# EAGLE design untitled (EAGLE 6.4)
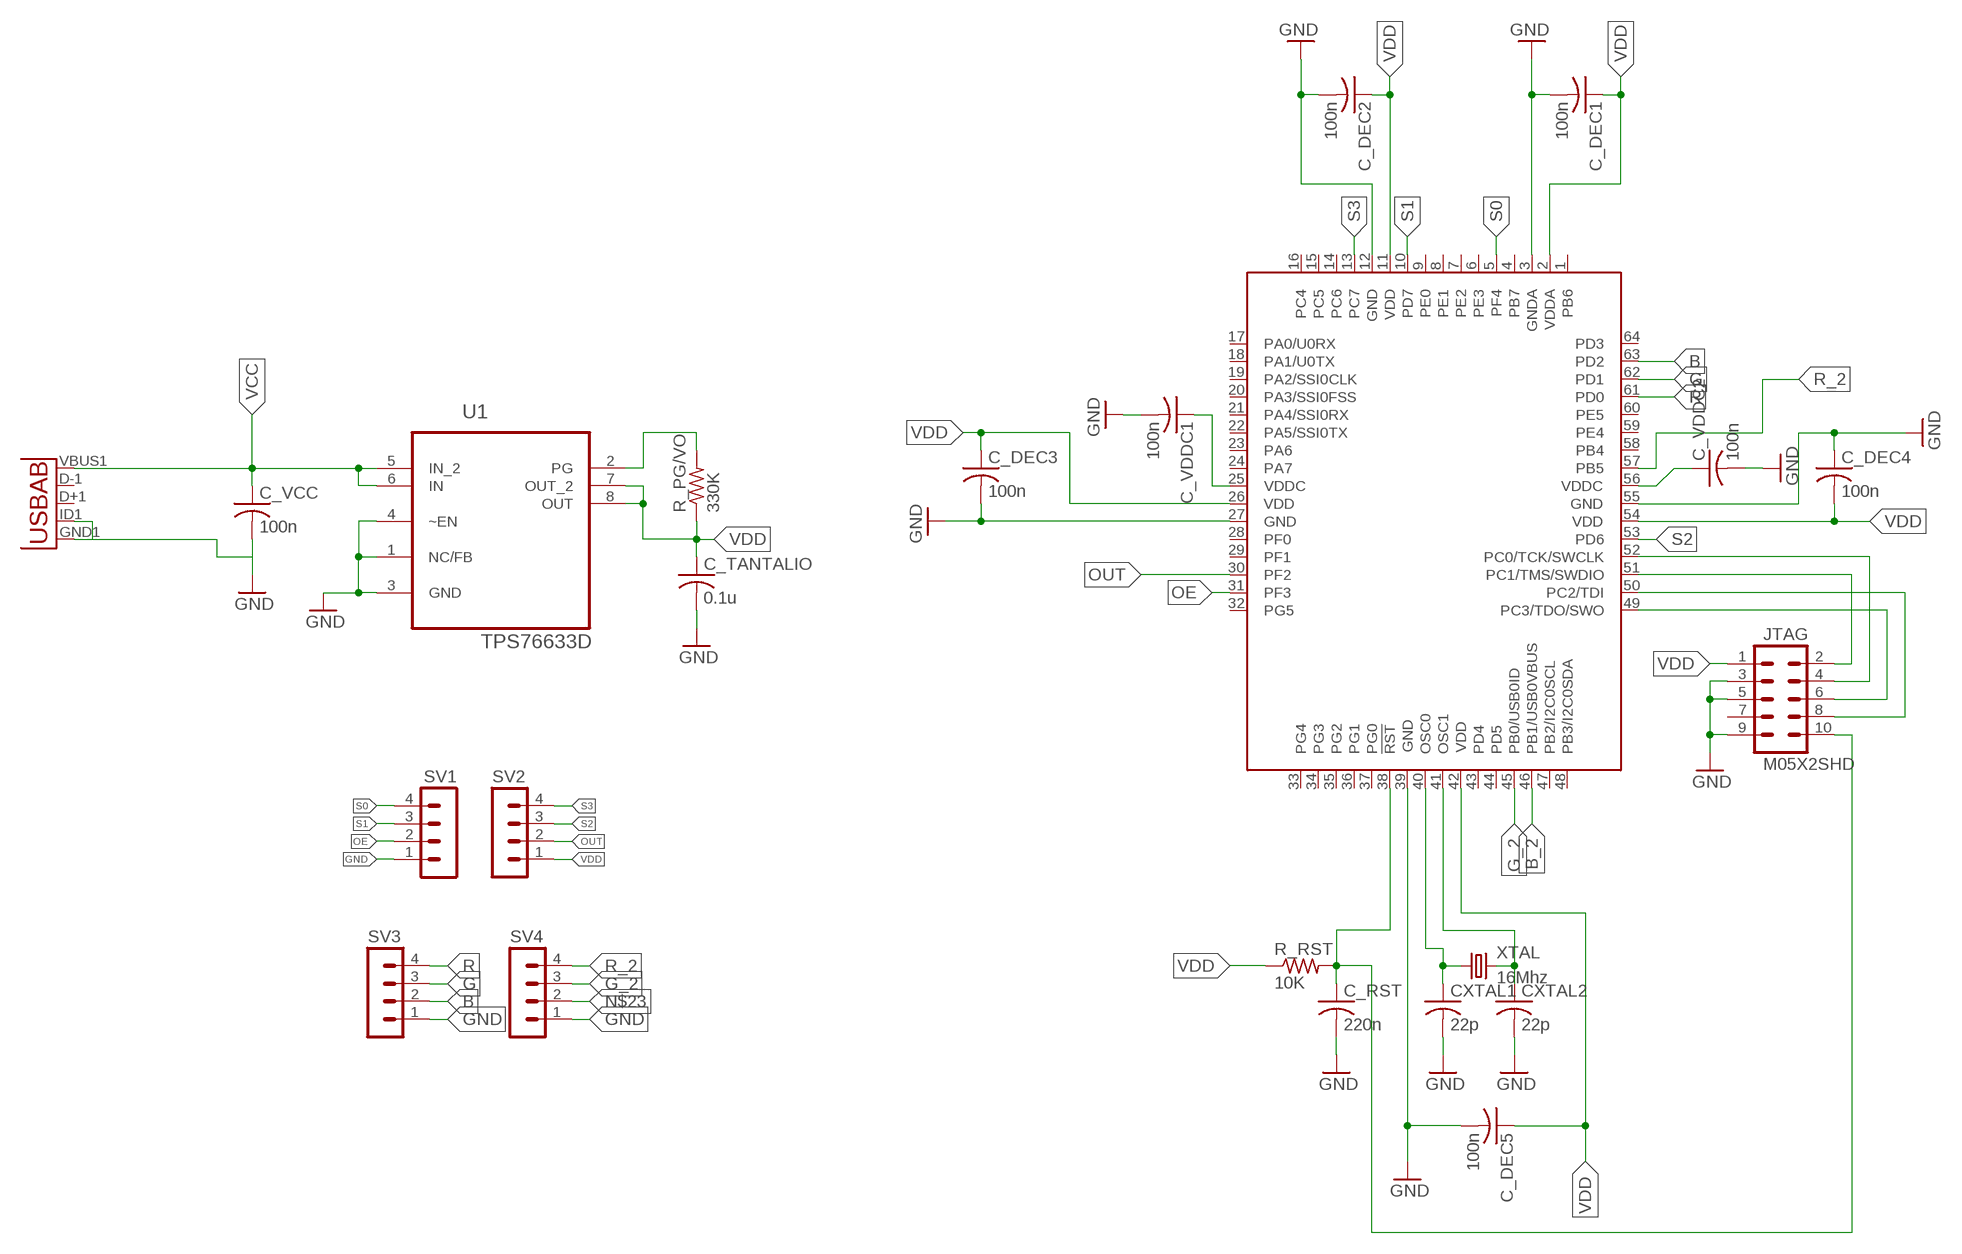
[diagram p0: schematic, sheet 1]

## Parts
C_DEC1  100n  C-USC0805  [C0805]
C_DEC2  100n  C-USC0805  [C0805]
C_DEC3  100n  C-USC0805  [C0805]
C_DEC4  100n  C-USC0805  [C0805]
C_DEC5  100n  C-USC0805  [C0805]
C_RST  220n  C-USC0805  [C0805]
C_TANTALIO  0.1u  C-USC1206  [C1206]
C_VCC  100n  C-USC0805  [C0805]
C_VDDC1  100n  C-USC0805  [C0805]
C_VDDC2  100n  C-USC0805  [C0805]
CXTAL1  22p  C-USC0805  [C0805]
CXTAL2  22p  C-USC0805  [C0805]
JTAG  M05X2SHD  [2X5-SHROUDED]
R_PG/VO  330K  R-US_M1206  [M1206]
R_RST  10K  R-US_M1206  [M1206]
SV1  MA04-1  [MA04-1]
SV2  MA04-1  [MA04-1]
SV3  MA04-1  [MA04-1]
SV4  MA04-1  [MA04-1]
TM4C123FH6PM  TM4C123[6,F]XXPM  [PM_S-PQFP-G64]
U1  TPS76633D  [SOIC127P600X175-8N]
U3  USB""  [USB-MICRO-SMD]
XTAL  16Mhz  CRYSTALHC49UP  [HC49UP]

## Nets
B: SV3.2 TM4C123FH6PM.63(PD2)
B_2: TM4C123FH6PM.46(PB1/USB0VBUS)
G: SV3.3 TM4C123FH6PM.62(PD1)
G_2: SV4.3 TM4C123FH6PM.45(PB0/USB0ID)
GND: C_DEC1.2 C_DEC2.2 C_DEC3.2 C_DEC4.1 C_DEC5.2 C_RST.2 C_TANTALIO.2 C_VCC.2 C_VDDC1.2 C_VDDC2.2 CXTAL1.2 CXTAL2.2 JTAG.3 JTAG.5 JTAG.9 SV1.1 SV3.1 SV4.1 TM4C123FH6PM.3(GNDA) TM4C123FH6PM.12(GND) TM4C123FH6PM.27(GND) TM4C123FH6PM.39(GND) TM4C123FH6PM.55(GND) U1.1(NC/FB) U1.3(GND) U1.4(~EN) U3.GND1(GND) U3.ID1(USBID)
N$1: CXTAL1.1 TM4C123FH6PM.40(OSC0) XTAL.1
N$2: CXTAL2.1 TM4C123FH6PM.41(OSC1) XTAL.2
N$5: C_VDDC1.1 TM4C123FH6PM.25(VDDC)
N$6: JTAG.2 TM4C123FH6PM.51(PC1/TMS/SWDIO)
N$7: JTAG.4 TM4C123FH6PM.52(PC0/TCK/SWCLK)
N$8: C_VDDC2.1 TM4C123FH6PM.56(VDDC)
N$9: JTAG.6 TM4C123FH6PM.49(PC3/TDO/SWO)
N$10: R_PG/VO.2 U1.2(PG)
N$11: JTAG.8 TM4C123FH6PM.50(PC2/TDI)
N$16: C_RST.1 JTAG.10 R_RST.2 TM4C123FH6PM.38(!RST)
N$23: SV4.2
OE: SV1.2 TM4C123FH6PM.31(PF3)
OUT: SV2.2 TM4C123FH6PM.30(PF2)
R: SV3.4 TM4C123FH6PM.61(PD0)
R_2: SV4.4 TM4C123FH6PM.57(PB5)
S0: SV1.4 TM4C123FH6PM.5(PF4)
S1: SV1.3 TM4C123FH6PM.10(PD7)
S2: SV2.3 TM4C123FH6PM.53(PD6)
S3: SV2.4 TM4C123FH6PM.13(PC7)
VCC: C_VCC.1 U1.5(IN_2) U1.6(IN) U3.VBUS1(VBUS)
VDD: C_DEC1.1 C_DEC2.1 C_DEC3.1 C_DEC4.2 C_DEC5.1 C_TANTALIO.1 JTAG.1 R_PG/VO.1 R_RST.1 SV2.1 TM4C123FH6PM.2(VDDA) TM4C123FH6PM.11(VDD) TM4C123FH6PM.26(VDD) TM4C123FH6PM.42(VDD) TM4C123FH6PM.54(VDD) U1.7(OUT_2) U1.8(OUT)
Unconnected: JTAG.7 TM4C123FH6PM.1(PB6) TM4C123FH6PM.4(PB7) TM4C123FH6PM.6(PE3) TM4C123FH6PM.7(PE2) TM4C123FH6PM.8(PE1) TM4C123FH6PM.9(PE0) TM4C123FH6PM.14(PC6) TM4C123FH6PM.15(PC5) TM4C123FH6PM.16(PC4) TM4C123FH6PM.17(PA0/U0RX) TM4C123FH6PM.18(PA1/U0TX) TM4C123FH6PM.19(PA2/SSI0CLK) TM4C123FH6PM.20(PA3/SSI0FSS) TM4C123FH6PM.21(PA4/SSI0RX) TM4C123FH6PM.22(PA5/SSI0TX) TM4C123FH6PM.23(PA6) TM4C123FH6PM.24(PA7) TM4C123FH6PM.28(PF0) TM4C123FH6PM.29(PF1) TM4C123FH6PM.32(PG5) TM4C123FH6PM.33(PG4) TM4C123FH6PM.34(PG3) TM4C123FH6PM.35(PG2) TM4C123FH6PM.36(PG1) TM4C123FH6PM.37(PG0) TM4C123FH6PM.43(PD4) TM4C123FH6PM.44(PD5) TM4C123FH6PM.47(PB2/I2C0SCL) TM4C123FH6PM.48(PB3/I2C0SDA) TM4C123FH6PM.58(PB4) TM4C123FH6PM.59(PE4) TM4C123FH6PM.60(PE5) TM4C123FH6PM.64(PD3) U3.D+1(D+) U3.D-1(D-)

## Library data of the parts
C_DEC1-C_DEC5 C_RST C_TANTALIO C_VCC C_VDDC1 C_VDDC2 CXTAL1 CXTAL2 = resistor:C-US: CAPACITOR, American symbol
JTAG = SparkFun-Connectors:M05X2: Header 5x2 Standard 10-pin dual row 0.1" header. Commonly used with AVR-ISP. Use with Spark Fun Electronics SKU: PRT-00778
R_PG/VO R_RST = resistor:R-US_: RESISTOR, American symbol
SV1-SV4 = con-lstb:MA04-1: PIN HEADER; OC_FARNELL: unknown; OC_NEWARK: unknown
TM4C123FH6PM = ti-tiva:TM4C123[6,F]XX
U1 = Texas Instruments_By_element14_Batch_1:TPS76633D: ULTRALOW QUIESCENT CURRENT 250-mA LOW DROPOUT VOLTAGE REGULATORS; MPN: TPS76633D; OC_FARNELL: 8461422; OC_NEWARK: 77C1060; PACKAGE: SOIC-8; SUPPLIER: Texas Instruments
U3 = MicroUSB:USB: This is a USB AB connector that is compatible with USB OTG. i.e. this connector can serve as a host or device
XTAL = crystal:CRYSTAL: CRYSTAL; OC_FARNELL: unknown; OC_NEWARK: unknown

## Board
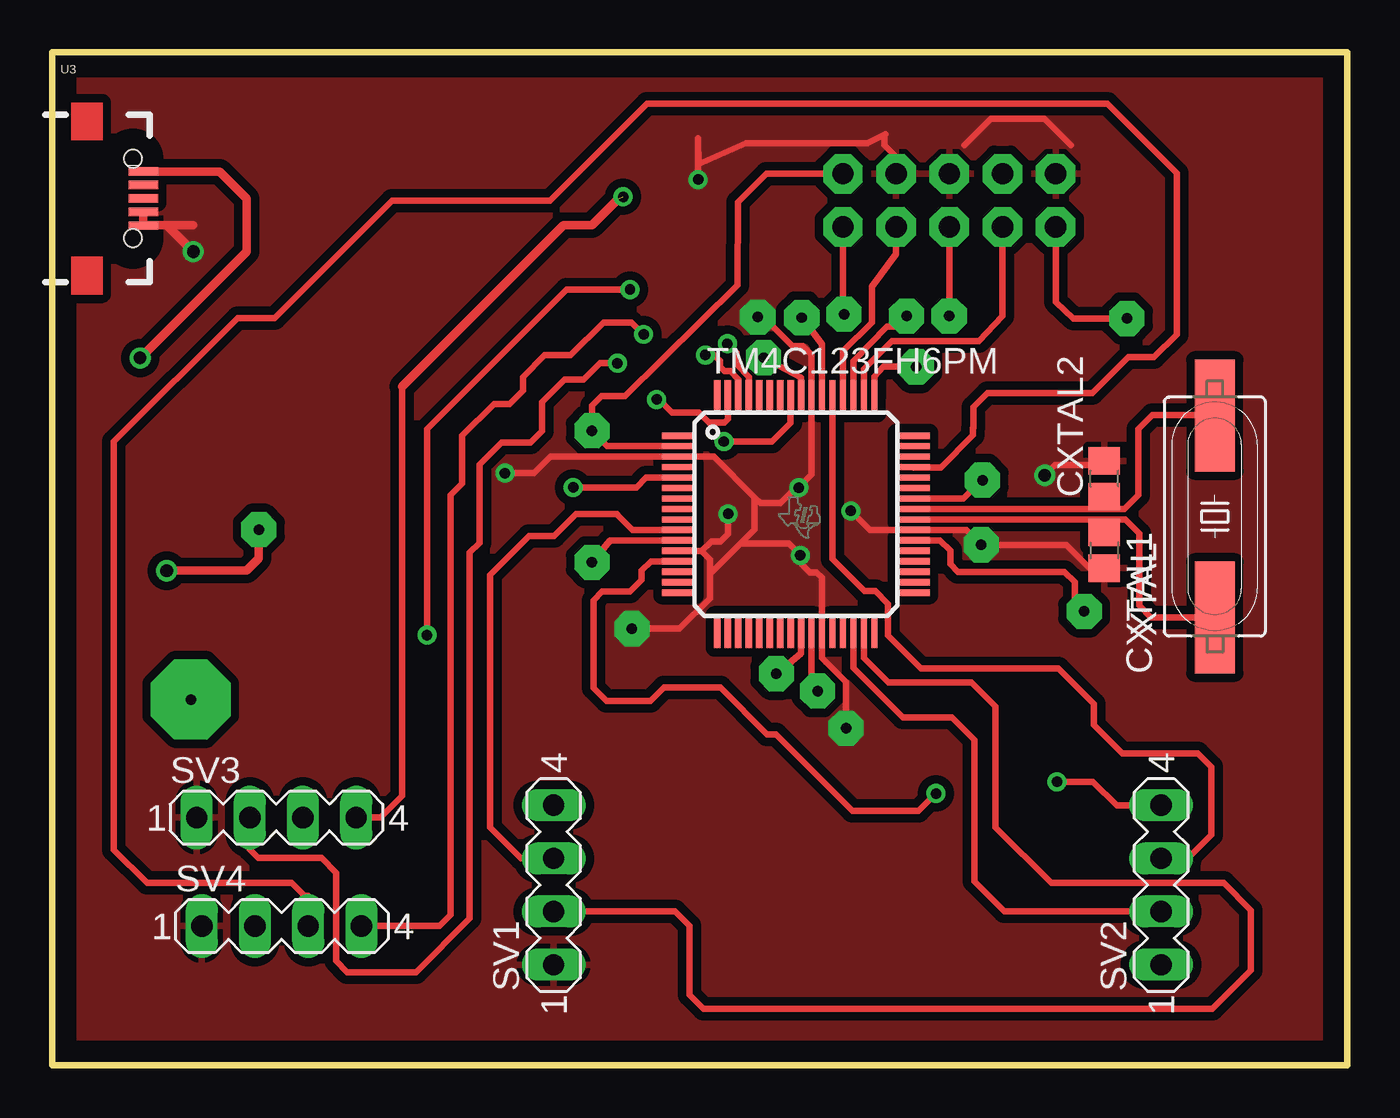
[diagram p1: board, top side]
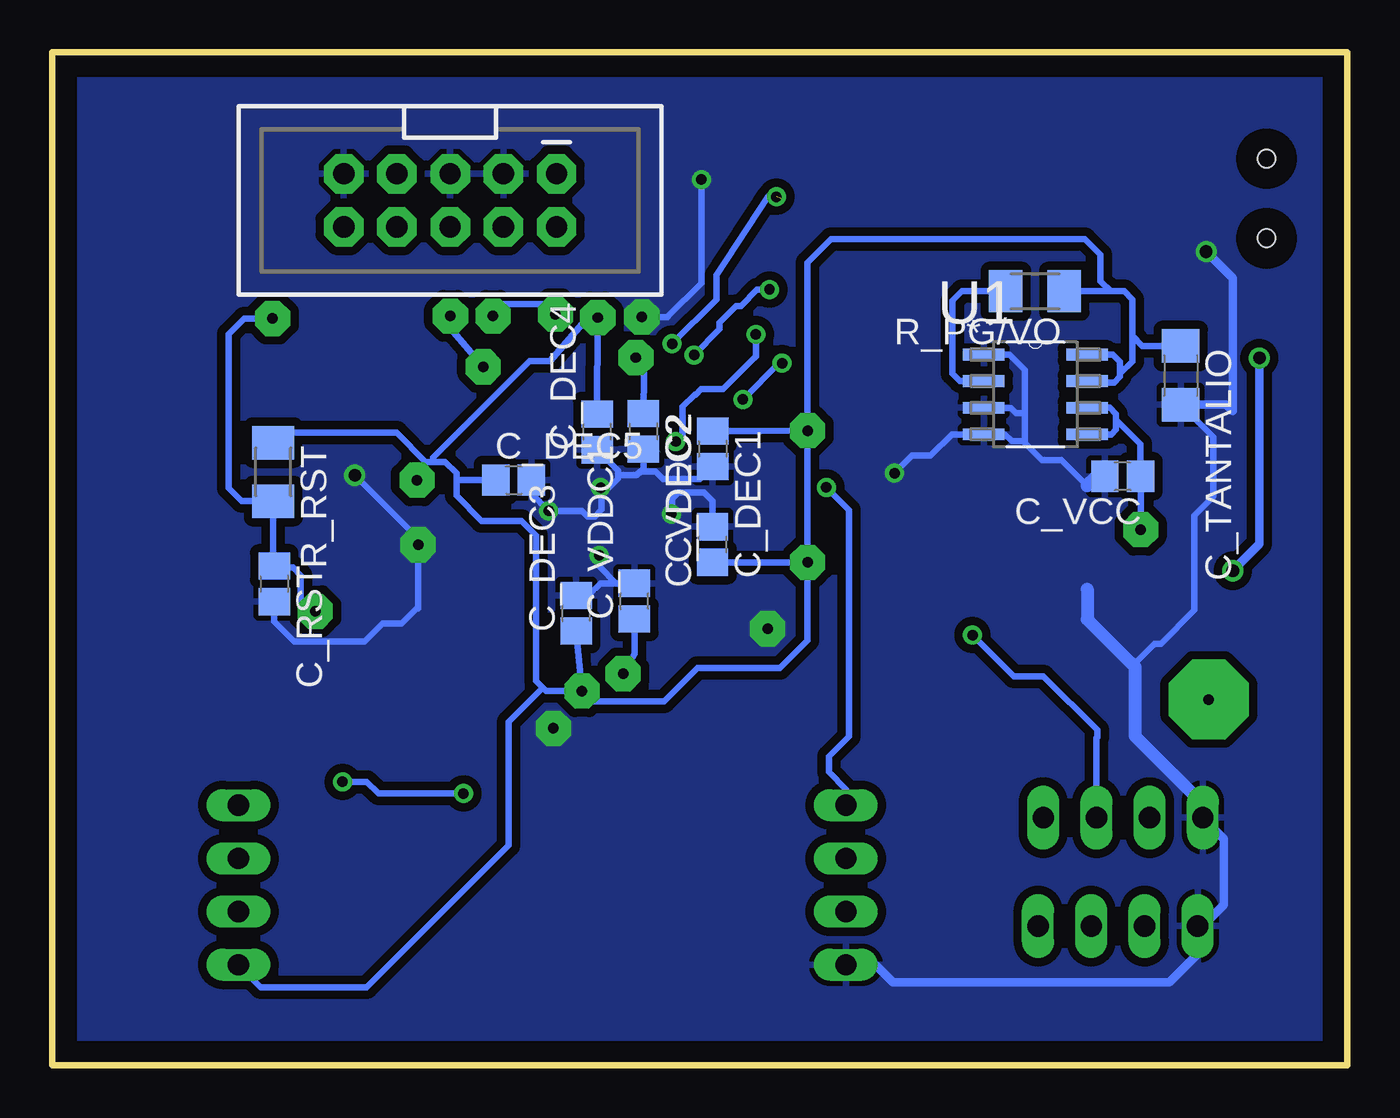
[diagram p2: board, bottom side, seen from below]

Size 61.84 x 48.38 mm. Coordinates in mm from the lower left corner, seen from the top.
Outline: 61.84,0 0,0 0,48.38 61.84,48.38 61.84,0
Copper layers (1*16): Top 0.035mm / dielectric 1.5mm / Bottom 0.035mm
Design rules "default *": minimum track width 10mil, minimum drill 24mil, track to track 8mil, track to pad 8mil, pad to pad 8mil, via to via 8mil, smd to smd 8mil, copper to edge 40mil, drill to drill 8mil, minimum pad ring 10mil, minimum via ring 8mil, stop-mask expansion 4mil, vias tented up to drill 0mil, thermal gap 10mil

### Footprints (pad centres in the part's own frame; a part is rotated, then mirrored left to right if it is on the bottom)
C0805 = smd 1.3 x 1.5: 1 -0.85,0; 2 0.85,0
C1206 = smd 1.6 x 1.8: 1 -1.4,0; 2 1.4,0
2X5-SHROUDED = drill 1.016 pad 1.88 octagon: 1 -1.27,5.08; 2 1.27,5.08; 3 -1.27,2.54; 4 1.27,2.54; 5 -1.27,0; 6 1.27,0; 7 -1.27,-2.54; 8 1.27,-2.54; 9 -1.27,-5.08; 10 1.27,-5.08
M1206 = smd 1.6 x 2: 1 -1.4,0; 2 1.4,0
MA04-1 = drill 1.016 long: 1 -3.81,0; 2 -1.27,0; 3 1.27,0; 4 3.81,0
PM_S-PQFP-G64 = smd 1.6 x 0.3: 1 -5.6,3.75; 2 -5.6,3.25; 3 -5.6,2.75; 4 -5.6,2.25; 5 -5.6,1.75; 6 -5.6,1.25; 7 -5.6,0.75; 8 -5.6,0.25; 9 -5.6,-0.25; 10 -5.6,-0.75; 11 -5.6,-1.25; 12 -5.6,-1.75; 13 -5.6,-2.25; 14 -5.6,-2.75; 15 -5.6,-3.25; 16 -5.6,-3.75; 33 5.6,-3.75; 34 5.6,-3.25; 35 5.6,-2.75; 36 5.6,-2.25; 37 5.6,-1.75; 38 5.6,-1.25; 39 5.6,-0.75; 40 5.6,-0.25; 41 5.6,0.25; 42 5.6,0.75; 43 5.6,1.25; 44 5.6,1.75; 45 5.6,2.25; 46 5.6,2.75; 47 5.6,3.25; 48 5.6,3.75 | smd 0.3 x 1.6: 17 -3.75,-5.6; 18 -3.25,-5.6; 19 -2.75,-5.6; 20 -2.25,-5.6; 21 -1.75,-5.6; 22 -1.25,-5.6; 23 -0.75,-5.6; 24 -0.25,-5.6; 25 0.25,-5.6; 26 0.75,-5.6; 27 1.25,-5.6; 28 1.75,-5.6; 29 2.25,-5.6; 30 2.75,-5.6; 31 3.25,-5.6; 32 3.75,-5.6; 49 3.75,5.6; 50 3.25,5.6; 51 2.75,5.6; 52 2.25,5.6; 53 1.75,5.6; 54 1.25,5.6; 55 0.75,5.6; 56 0.25,5.6; 57 -0.25,5.6; 58 -0.75,5.6; 59 -1.25,5.6; 60 -1.75,5.6; 61 -2.25,5.6; 62 -2.75,5.6; 63 -3.25,5.6; 64 -3.75,5.6
SOIC127P600X175-8N = smd 1.981 x 0.559: 1 -2.464,1.905; 2 -2.464,0.635; 3 -2.464,-0.635; 4 -2.464,-1.905; 5 2.464,-1.905; 6 2.464,-0.635; 7 2.464,0.635; 8 2.464,1.905
USB-MICRO-SMD = smd 1.4 x 0.4: D+1 2.7,0; D-1 2.7,0.65; GND1 2.7,-1.3; ID1 2.7,-0.65; VBUS1 2.7,1.3 | hole 0.85: 2.2,1.9; 2.2,-1.9
HC49UP = smd 5.334 x 1.93: 1 -4.826,0; 2 4.826,0

### Placement (x,y rotation side)
C_DEC1  30.3,29.44 270 bottom
C_DEC2  30.31,24.87 90 bottom
C_DEC3  36.82,21.59 90 bottom
C_DEC4  35.82,30.25 90 bottom
C_DEC5  39.81,27.95 0 bottom
C_RST  51.24,22.99 270 bottom
C_TANTALIO  7.95,32.95 270 bottom
C_VCC  10.72,28.13 180 bottom
C_VDDC1  34.04,22.17 90 bottom
C_VDDC2  33.61,30.28 270 bottom
CXTAL1  50.24,24.59 270 top
CXTAL2  50.24,28.02 90 top
JTAG  42.84,41.31 270 bottom
R_PG/VO  14.91,36.97 180 bottom
R_RST  51.29,28.34 270 bottom
SV1  23.94,8.61 90 top
SV2  52.95,8.61 90 top
SV3  10.7,11.83 0 top
SV4  10.95,6.65 0 top
TM4C123FH6PM  35.51,26.32 0 top
U1  14.89,32.04 0 bottom
U3  1.65,41.4 0 top
XTAL  55.52,26.21 90 top

### Tracks (layer width: path | path; a pad name or v marks a point on that pad's centre or on a via)
B  (via drill 0.5)
  Top 0.305: TM4C123FH6PM.63 32.27,30.87 32.09,30.69 31.37,30.69 30.88,31.18 29.6,31.18 28.98,31.8 v28.86,31.8 | v26.99,33.53 26.16,33.53 25.37,32.74 24.46,32.74 23.39,31.67 23.39,30.29 22.85,29.75 21.46,29.75 20.4,28.69 20.4,24.95 19.93,24.48 19.93,7.01 17.37,4.45 14.09,4.45 13.55,4.99 13.55,9.2 12.85,9.9 9.83,9.9 9.43,10.3 SV3.2
  Bottom 0.305: v28.86,31.8 27.13,33.53 v26.99,33.53
G  (via drill 0.5)
  Top 0.305: TM4C123FH6PM.62 32.78,31.94 32.78,32.75 32.38,33.15 32.11,33.15 31.88,33.38 31.88,33.66 31.87,33.66 31.6,33.93 v31.19,33.93 | v27.59,37.05 24.55,37.05 17.89,30.39 v17.89,20.55
  Bottom 0.305: v31.19,33.93 29.97,35.15 29.97,35.48 29.18,36.27 28.96,36.27 28.18,37.05 v27.59,37.05 | v17.89,20.55 15.92,18.58 14.5,18.58 11.94,16.02 11.94,15.66 11.97,15.63 SV3.3
G_2
  Top 0.305: TM4C123FH6PM.45 42.44,28.56 43.97,30.09 43.97,30.43 43.98,30.44 43.98,31.43 44.65,32.1 49.68,32.1 51.4,33.82 52.61,33.82 53.7,34.91 53.7,42.61 50.38,45.93 28.39,45.93 23.76,41.3 16.23,41.3 10.62,35.69 8.84,35.69 2.94,29.79 2.94,10.29 4.52,8.71 11.44,8.71 12.06,8.09 12.22,8.09 SV4.3
GND  (via drill 0.5, 0.5 pad 1.68, 0.6)
  Top 0.305: v33.69,35.74 33.97,35.74 35.36,34.35 35.85,34.35 36.26,33.94 TM4C123FH6PM.55 36.26,28.22 35.65,27.61 v35.65,27.59 35.51,27.59 34.77,26.85 33.81,26.85 33.54,27.12 | v37.91,16.09 37.91,18.31 36.76,19.46 TM4C123FH6PM.27 36.75,23.29 36.5,23.54 36.18,23.54 35.72,24 v35.72,24.35 35.72,24.4 35.19,24.93 32.87,24.93 | 31.01,24.55 30.99,24.57 TM4C123FH6PM.12 | 31.01,24.55 31.4,24.16 31.4,23.46 | 31.4,23.46 31.4,22.29 29.96,20.85 v27.68,20.85 | 32.87,24.93 31.4,23.46 | CXTAL1.2 50.18,23.8 49.49,23.8 48.44,24.85 48.27,24.85 48.26,24.86 v44.37,24.86 43.66,25.57 TM4C123FH6PM.39 39.04,25.57 v38.13,26.48 | CXTAL2.2 50.04,28.67 47.88,28.67 v47.4,28.19 v47.4,28.18 | v21.62,28.28 23,28.28 23.79,29.07 TM4C123FH6PM.3 31.59,29.07 33.54,27.12 | JTAG.5 | v30.84,42.3 30.84,44.29 30.86,43.04 30.86,43.05 33.13,44.05 38.94,44.05 39.79,44.47 39.75,44.43 39.75,43.94 40.3,43.39 JTAG.3 | TM4C123FH6PM.12 30.92,24.56 | 32.87,24.93 33.54,25.6 33.54,27.12 | TM4C123FH6PM.12 29.93,24.55 31.01,24.55 | 31.01,24.55 31.48,25.02 31.92,25.02 32.27,25.37 v32.27,26.33 | 43.56,43.94 44.83,45.21 47.37,45.21 48.64,43.94
  Top 0.406: U3.ID1 U3.GND1 4.38,40.13 5.46,40.13 | 6.73,40.13 5.46,40.13 | 5.46,40.13 v6.73,38.86
  Bottom 0.305: C_RST.2 51.24,21.19 50.3,20.25 46.92,20.25 46.06,21.11 45.15,21.11 44.44,21.82 44.37,21.82 v44.37,24.86 44.37,25.15 v47.4,28.18 | 12.42,27.68 13.65,28.91 14.59,28.91 15.39,29.71 | 15.39,29.71 15.39,31.16 | 15.39,31.16 15.39,33.2 16.13,33.95 U1.1 | 15.39,29.71 15.49,29.81 16.02,29.81 16.34,30.14 U1.4 | U1.3 16.06,31.4 15.82,31.16 15.39,31.16 | v35.72,24.35 v35.71,24.34 35.71,23.82 34.91,23.02 C_VDDC1.2 35.67,23.02 36.25,22.44 C_DEC3.2 36.81,22.46 | v21.62,28.28 20.79,29.11 19.9,29.11 18.88,30.13 18.15,30.13 | v30.84,42.3 30.84,37.36 32.45,35.75 32.46,35.75 32.47,35.74 v33.69,35.74 | C_DEC4.1 34.82,28.4 34.82,28.18 | 34.82,28.18 34.82,28.03 35.26,27.59 v35.65,27.59 35.61,27.55 35.61,26.54 35.93,26.22 36.29,26.22 36.55,26.48 v38.13,26.48 38.96,27.31 C_DEC5.2 | C_VDDC2.2 33.61,28.5 33.76,28.35 | 33.76,28.35 33.93,28.18 34.82,28.18 | v32.27,26.33 32.25,26.35 32.25,27.05 31.94,27.36 30.71,27.36 30.31,26.96 C_DEC2.2 | C_TANTALIO.2 6.4,30 6.4,27.16 7.3,26.26 7.3,21.74 8.91,20.13 9.21,20.13 10.17,19.17 10.28,19.17 | C_DEC1.2 30.9,27.99 32.67,27.99 33.03,28.35 33.76,28.35
  Bottom 0.406: SV1.1 22.53,4.8 21.7,3.97 8.5,3.97 7.14,5.33 SV4.1 6.9,6.65 5.88,7.67 5.88,10.82 SV3.1 | v6.73,38.86 5.46,37.59 5.46,31.24 5.77,31.55 C_TANTALIO.2
  Bottom 0.61: 12.42,27.68 11.97,28.13 C_VCC.2 | 12.41,22.74 12.41,21.3 10.28,19.17 10.13,19.02 10.13,15.74 6.86,12.47 6.86,12.42 6.89,12.39 SV3.1
  pour Bottom (isolate 0.406): 0.38,47.75 61.34,47.75 61.34,0.76 0.38,0.76
  pour Top (isolate 0.406): 0.38,47.75 61.34,47.75 61.34,0.76 0.38,0.76
N$1
  Top 0.305: TM4C123FH6PM.40 50.18,26.07 | 50.18,26.07 51.24,26.07 51.91,25.4 51.91,21.95 52.47,21.39 XTAL.1 | CXTAL1.1 50.24,26.01 50.18,26.07
N$2
  Top 0.305: TM4C123FH6PM.41 50.28,26.57 | 50.28,26.57 51.2,26.57 51.87,27.24 51.87,30.39 52.53,31.05 55.51,31.05 XTAL.2 | CXTAL2.1 50.24,26.61 50.28,26.57
N$3  (via drill 0.5 pad 3.81)
  other vias: 6.61,17.47
N$5  (via drill 0.5 pad 1.68)
  Top 0.305: TM4C123FH6PM.25 35.76,19.66 v34.58,18.7
  Bottom 0.305: v34.58,18.7 34.04,19.64 C_VDDC1.1
N$6  (via drill 0.5 pad 1.68)
  Top 0.305: TM4C123FH6PM.51 38.26,33.63 39.87,35.27 40.4,35.27 v40.8,35.79 | v37.81,35.87 37.76,36.46 JTAG.2
  Bottom 0.305: v40.8,35.79 40.78,36.11 40.53,36.36 38.35,36.36 v37.81,35.87
N$7
  Top 0.305: TM4C123FH6PM.52 37.75,34.11 39.15,35.47 39.14,37.19 40.3,38.73 JTAG.4
N$8  (via drill 0.5 pad 1.68)
  Top 0.305: TM4C123FH6PM.56 35.76,32.84 v33.97,33.8
  Bottom 0.305: v33.97,33.8 33.58,33.05 C_VDDC2.1
N$9  (via drill 0.5 pad 1.68)
  Top 0.305: TM4C123FH6PM.49 39.26,32.9 39.69,33.36 v41.26,33.36 | v42.83,35.79 42.84,35.88 JTAG.6
  Bottom 0.305: v41.26,33.36 42.81,35.18 v42.83,35.79
N$10
  Bottom 0.305: U1.2 18.5,32.67 18.86,33.03 18.86,36.52 18.41,36.97 R_PG/VO.2
N$11
  Top 0.305: TM4C123FH6PM.50 38.76,33.24 40.09,34.58 44.25,34.59 45.38,35.77 JTAG.8
N$16  (via drill 0.5 pad 1.68)
  Top 0.305: v51.32,35.67 48.76,35.67 47.92,36.45 JTAG.10 | TM4C123FH6PM.38 42.4,25.07 42.88,24.59 42.88,23.95 43.26,23.57 48.33,23.57 48.83,23.07 48.83,22.13 v49.28,21.68
  Bottom 0.305: v51.32,35.67 52.67,35.67 53.41,34.93 53.41,27.56 52.79,26.94 R_RST.2 51.29,23.84 C_RST.1 51.17,23.77 50.35,23.77 49.98,23.4 49.98,21.93 49.73,21.68 v49.28,21.68
OE
  Top 0.305: TM4C123FH6PM.31 38.76,19.45 39.93,18.28 43.89,18.28 45.04,17.13 45.04,11.37 47.71,8.7 55.94,8.7 57.23,7.41 57.23,4.54 55.39,2.7 31.09,2.7 30.43,3.36 30.43,6.66 29.75,7.34 SV1.2
OUT
  Top 0.305: TM4C123FH6PM.30 38.27,18.97 40.63,16.61 42.97,16.61 44.03,15.55 44.03,8.79 45.48,7.34 SV2.2
R  (via drill 0.5)  (1 unrouted)
  Top 0.305: TM4C123FH6PM.61 33.28,31.94 33.28,32.87 32.67,33.48 32.67,34.04 v32.25,34.46 v32.24,34.46 | 16.7,32.41 16.7,12.86 15.67,11.83 SV3.4
  Top 0.406: 16.7,32.41 24.42,40.13 25.78,40.13 27.05,41.4
  Bottom 0.305: v32.24,34.46 30.13,36.57 30.13,37.74 27.66,41.48 v27.26,41.48
R_2  (via drill 0.5)
  Top 0.305: TM4C123FH6PM.57 35.26,30.67 34.38,29.79 v32.07,29.79 | v28.24,34.91 27.67,35.48 26.32,35.48 24.75,33.91 23.5,33.91 22.47,32.88 22.47,32.22 21.84,31.59 21.09,31.59 19.58,30.08 19.58,27.78 19.03,27.23 19.03,7.19 18.49,6.65 SV4.4
  Bottom 0.305: v32.07,29.79 31.74,30.12 31.74,31.45 31.15,32.04 31.11,32.04 30.86,32.29 29.81,32.29 28.3,33.8 28.29,33.8 28.24,33.85 v28.24,34.91
S0  (via drill 0.5)
  Top 0.305: TM4C123FH6PM.5 28.36,28.07 27.89,27.6 v24.88,27.6
  Bottom 0.305: v24.88,27.6 23.79,26.51 23.79,15.71 24.76,14.74 24.76,14 23.94,13.18 SV1.4
S1
  Top 0.305: TM4C123FH6PM.10 27.71,25.57 26.98,26.3 26.98,26.33 26.97,26.32 25.01,26.32 23.97,25.28 22.77,25.28 20.91,23.42 20.91,11.35 22.38,9.88 SV1.3
S2
  Top 0.305: TM4C123FH6PM.53 37.26,24.18 38.79,22.65 39.3,22.65 39.91,22.04 39.91,20.53 41.48,18.96 48.04,18.96 49.74,17.26 49.74,16.26 51.11,14.89 54.71,14.89 55.35,14.25 55.35,11 54.23,9.88 SV2.3
S3  (via drill 0.5)
  Top 0.305: SV2.4 50.83,12.41 49.7,13.54 v47.98,13.54 | v42.2,12.98 41.37,12.15 38.21,12.15 34.56,15.8 34.14,15.8 31.9,18.04 29.22,18.04 28.57,17.39 26.47,17.39 25.85,18.01 25.85,22.21 26.26,22.62 27.6,22.62 28.15,23.17 28.15,23.62 28.6,24.07 TM4C123FH6PM.13
  Bottom 0.305: v47.98,13.54 46.82,13.54 46.26,12.98 v42.2,12.98
VCC  (via drill 0.5 pad 1.68, 0.6)
  Top 0.305: v9.86,25.58 9.88,25.42
  Top 0.406: U3.VBUS1 4.38,42.67 8,42.67 9.27,41.4 9.27,38.86 v4.19,33.78 | v5.46,23.62 9.27,23.62 9.86,24.21 v9.86,25.58
  Bottom 0.305: U1.6 11.35,31.41 11.04,31.1 11.04,30.83 | 11.04,30.83 11.04,30.36 11.27,30.13 U1.5 | 11.04,30.83 9.87,29.66 C_VCC.1 v9.86,25.58
  Bottom 0.406: v4.19,33.78 4.19,24.89 v5.46,23.62
VDD  (via drill 0.5 pad 1.68)
  Top 0.305: TM4C123FH6PM.2 26.5,29.58 v25.77,30.31 25.77,31.5 26.22,31.95 27.34,31.95 32.73,37.25 32.75,41.23 34.1,42.58 JTAG.1 | TM4C123FH6PM.11 26.64,25.07 v25.77,24.02 | TM4C123FH6PM.54 36.76,34.45 v35.79,35.71 | TM4C123FH6PM.42 43.52,27.07 v44.42,27.95 | TM4C123FH6PM.26 36.26,18.32 v36.55,17.87
  Bottom 0.305: U1.8 11.19,33.95 10.85,33.61 10.85,33.03 | 10.85,33.03 10.85,32.89 11.13,32.61 12.36,32.61 U1.7 | R_PG/VO.1 11.29,36.97 | 11.29,36.97 10.65,36.97 10.26,36.58 10.26,34.84 | 10.26,34.84 10.26,33.62 10.85,33.03 | C_TANTALIO.1 9.77,34.35 10.26,34.84 | v25.77,30.31 28.01,30.3 C_DEC1.1 | v25.77,30.31 25.77,38.34 24.65,39.46 12.52,39.46 11.78,38.72 11.78,37.46 11.29,36.97 | v25.77,24.02 25.78,30.22 v25.77,30.31 | C_DEC2.1 v25.77,24.02 | v36.55,17.87 36.33,17.38 32.62,17.38 31.03,18.97 27.08,18.97 25.77,20.28 v25.77,24.02 | v44.42,27.95 44.42,28.41 44.01,28.82 | 44.01,28.82 43.66,28.82 | 43.66,28.82 43.08,28.82 42.54,28.28 42.54,28.04 | 42.54,28.04 42.54,27.2 41.33,25.99 39.44,25.99 38.74,25.29 38.74,18.35 38.45,18.07 | 38.45,18.07 38.26,17.87 v36.55,17.87 | 43.66,28.82 43.66,29.03 39.05,33.64 38.06,33.64 36.38,35.58 v35.79,35.71 C_DEC4.2 | C_DEC3.1 v36.55,17.87 | C_DEC5.1 42.45,27.95 42.54,28.04 | R_RST.1 50.82,30.21 45.4,30.21 44.01,28.82 | SV2.1 51.88,3.73 46.84,3.73 40.06,10.51 40.06,16.39 38.45,18 38.45,18.07